# EAGLE schematic smd-practice-manufactured-2016-10-13 (EAGLE 7.6.0)
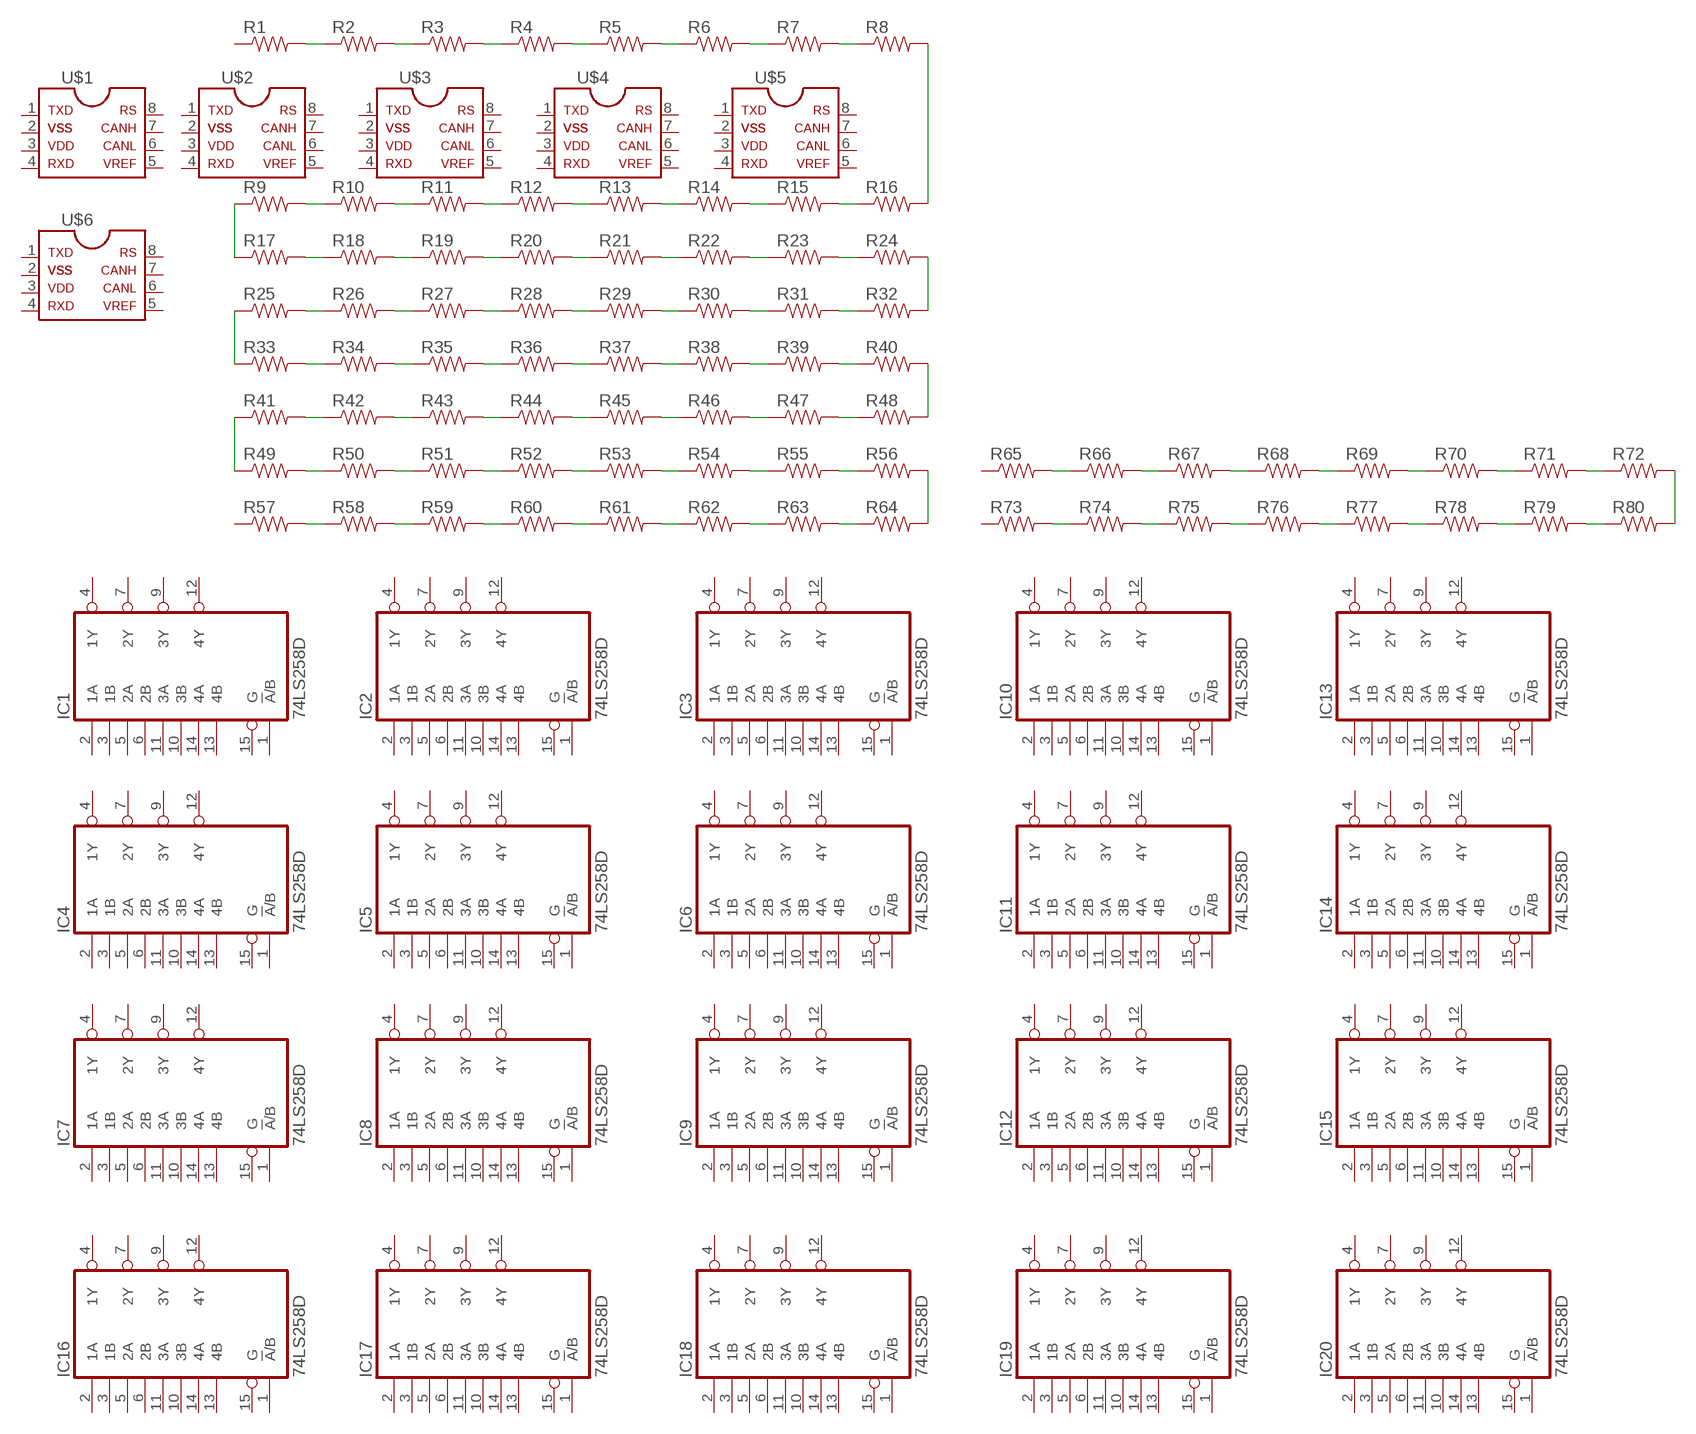
[diagram p0: schematic, sheet 1]

## Parts
IC1  74LS258D  [SO16]
IC2  74LS258D  [SO16]
IC3  74LS258D  [SO16]
IC4  74LS258D  [SO16]
IC5  74LS258D  [SO16]
IC6  74LS258D  [SO16]
IC7  74LS258D  [SO16]
IC8  74LS258D  [SO16]
IC9  74LS258D  [SO16]
IC10  74LS258D  [SO16]
IC11  74LS258D  [SO16]
IC12  74LS258D  [SO16]
IC13  74LS258D  [SO16]
IC14  74LS258D  [SO16]
IC15  74LS258D  [SO16]
IC16  74LS258D  [SO16]
IC17  74LS258D  [SO16]
IC18  74LS258D  [SO16]
IC19  74LS258D  [SO16]
IC20  74LS258D  [SO16]
R1  RESISTOR0805-RES  [0805]
R2  RESISTOR0805-RES  [0805]
R3  RESISTOR0805-RES  [0805]
R4  RESISTOR0805-RES  [0805]
R5  RESISTOR0805-RES  [0805]
R6  RESISTOR0805-RES  [0805]
R7  RESISTOR0805-RES  [0805]
R8  RESISTOR0805-RES  [0805]
R9  RESISTOR0805-RES  [0805]
R10  RESISTOR0805-RES  [0805]
R11  RESISTOR0805-RES  [0805]
R12  RESISTOR0805-RES  [0805]
R13  RESISTOR0805-RES  [0805]
R14  RESISTOR0805-RES  [0805]
R15  RESISTOR0805-RES  [0805]
R16  RESISTOR0805-RES  [0805]
R17  RESISTOR0805-RES  [0805]
R18  RESISTOR0805-RES  [0805]
R19  RESISTOR0805-RES  [0805]
R20  RESISTOR0805-RES  [0805]
R21  RESISTOR0805-RES  [0805]
R22  RESISTOR0805-RES  [0805]
R23  RESISTOR0805-RES  [0805]
R24  RESISTOR0805-RES  [0805]
R25  RESISTOR0805-RES  [0805]
R26  RESISTOR0805-RES  [0805]
R27  RESISTOR0805-RES  [0805]
R28  RESISTOR0805-RES  [0805]
R29  RESISTOR0805-RES  [0805]
R30  RESISTOR0805-RES  [0805]
R31  RESISTOR0805-RES  [0805]
R32  RESISTOR0805-RES  [0805]
R33  RESISTOR0805-RES  [0805]
R34  RESISTOR0805-RES  [0805]
R35  RESISTOR0805-RES  [0805]
R36  RESISTOR0805-RES  [0805]
R37  RESISTOR0805-RES  [0805]
R38  RESISTOR0805-RES  [0805]
R39  RESISTOR0805-RES  [0805]
R40  RESISTOR0805-RES  [0805]
R41  RESISTOR0805-RES  [0805]
R42  RESISTOR0805-RES  [0805]
R43  RESISTOR0805-RES  [0805]
R44  RESISTOR0805-RES  [0805]
R45  RESISTOR0805-RES  [0805]
R46  RESISTOR0805-RES  [0805]
R47  RESISTOR0805-RES  [0805]
R48  RESISTOR0805-RES  [0805]
R49  RESISTOR0805-RES  [0805]
R50  RESISTOR0805-RES  [0805]
R51  RESISTOR0805-RES  [0805]
R52  RESISTOR0805-RES  [0805]
R53  RESISTOR0805-RES  [0805]
R54  RESISTOR0805-RES  [0805]
R55  RESISTOR0805-RES  [0805]
R56  RESISTOR0805-RES  [0805]
R57  RESISTOR0805-RES  [0805]
R58  RESISTOR0805-RES  [0805]
R59  RESISTOR0805-RES  [0805]
R60  RESISTOR0805-RES  [0805]
R61  RESISTOR0805-RES  [0805]
R62  RESISTOR0805-RES  [0805]
R63  RESISTOR0805-RES  [0805]
R64  RESISTOR0805-RES  [0805]
R65  RESISTOR0805-RES  [0805]
R66  RESISTOR0805-RES  [0805]
R67  RESISTOR0805-RES  [0805]
R68  RESISTOR0805-RES  [0805]
R69  RESISTOR0805-RES  [0805]
R70  RESISTOR0805-RES  [0805]
R71  RESISTOR0805-RES  [0805]
R72  RESISTOR0805-RES  [0805]
R73  RESISTOR0805-RES  [0805]
R74  RESISTOR0805-RES  [0805]
R75  RESISTOR0805-RES  [0805]
R76  RESISTOR0805-RES  [0805]
R77  RESISTOR0805-RES  [0805]
R78  RESISTOR0805-RES  [0805]
R79  RESISTOR0805-RES  [0805]
R80  RESISTOR0805-RES  [0805]
U$1  MCP2551  [SOIC-08]
U$2  MCP2551  [SOIC-08]
U$3  MCP2551  [SOIC-08]
U$4  MCP2551  [SOIC-08]
U$5  MCP2551  [SOIC-08]
U$6  MCP2551  [SOIC-08]

## Nets
N$1: R1.2 R2.1
N$2: R2.2 R3.1
N$3: R3.2 R4.1
N$4: R5.2 R6.1
N$5: R6.2 R7.1
N$6: R7.2 R8.1
N$7: R4.2 R5.1
N$8: R9.2 R10.1
N$9: R10.2 R11.1
N$10: R11.2 R12.1
N$11: R13.2 R14.1
N$12: R14.2 R15.1
N$13: R15.2 R16.1
N$14: R12.2 R13.1
N$15: R8.2 R16.2
N$16: R17.2 R18.1
N$17: R18.2 R19.1
N$18: R19.2 R20.1
N$19: R21.2 R22.1
N$20: R22.2 R23.1
N$21: R23.2 R24.1
N$22: R20.2 R21.1
N$23: R25.2 R26.1
N$24: R26.2 R27.1
N$25: R27.2 R28.1
N$26: R29.2 R30.1
N$27: R30.2 R31.1
N$28: R31.2 R32.1
N$29: R28.2 R29.1
N$30: R24.2 R32.2
N$31: R9.1 R17.1
N$32: R33.2 R34.1
N$33: R34.2 R35.1
N$34: R35.2 R36.1
N$35: R37.2 R38.1
N$36: R38.2 R39.1
N$37: R39.2 R40.1
N$38: R36.2 R37.1
N$39: R41.2 R42.1
N$40: R42.2 R43.1
N$41: R43.2 R44.1
N$42: R45.2 R46.1
N$43: R46.2 R47.1
N$44: R47.2 R48.1
N$45: R44.2 R45.1
N$46: R40.2 R48.2
N$47: R49.2 R50.1
N$48: R50.2 R51.1
N$49: R51.2 R52.1
N$50: R53.2 R54.1
N$51: R54.2 R55.1
N$52: R55.2 R56.1
N$53: R52.2 R53.1
N$54: R57.2 R58.1
N$55: R58.2 R59.1
N$56: R59.2 R60.1
N$57: R61.2 R62.1
N$58: R62.2 R63.1
N$59: R63.2 R64.1
N$60: R60.2 R61.1
N$61: R56.2 R64.2
N$62: R41.1 R49.1
N$63: R25.1 R33.1
N$64: R65.2 R66.1
N$65: R66.2 R67.1
N$66: R67.2 R68.1
N$67: R69.2 R70.1
N$68: R70.2 R71.1
N$69: R71.2 R72.1
N$70: R68.2 R69.1
N$71: R73.2 R74.1
N$72: R74.2 R75.1
N$73: R75.2 R76.1
N$74: R77.2 R78.1
N$75: R78.2 R79.1
N$76: R79.2 R80.1
N$77: R76.2 R77.1
N$78: R72.2 R80.2
Unconnected: IC1.1(!A!/B) IC1.2(1A) IC1.3(1B) IC1.4(1Y) IC1.5(2A) IC1.6(2B) IC1.7(2Y) IC1.9(3Y) IC1.10(3B) IC1.11(3A) IC1.12(4Y) IC1.13(4B) IC1.14(4A) IC1.15(G) IC2.1(!A!/B) IC2.2(1A) IC2.3(1B) IC2.4(1Y) IC2.5(2A) IC2.6(2B) IC2.7(2Y) IC2.9(3Y) IC2.10(3B) IC2.11(3A) IC2.12(4Y) IC2.13(4B) IC2.14(4A) IC2.15(G) IC3.1(!A!/B) IC3.2(1A) IC3.3(1B) IC3.4(1Y) IC3.5(2A) IC3.6(2B) IC3.7(2Y) IC3.9(3Y) IC3.10(3B) IC3.11(3A) IC3.12(4Y) IC3.13(4B) IC3.14(4A) IC3.15(G) IC4.1(!A!/B) IC4.2(1A) IC4.3(1B) IC4.4(1Y) IC4.5(2A) IC4.6(2B) IC4.7(2Y) IC4.9(3Y) IC4.10(3B) IC4.11(3A) IC4.12(4Y) IC4.13(4B) IC4.14(4A) IC4.15(G) IC5.1(!A!/B) IC5.2(1A) IC5.3(1B) IC5.4(1Y) IC5.5(2A) IC5.6(2B) IC5.7(2Y) IC5.9(3Y) IC5.10(3B) IC5.11(3A) IC5.12(4Y) IC5.13(4B) IC5.14(4A) IC5.15(G) IC6.1(!A!/B) IC6.2(1A) IC6.3(1B) IC6.4(1Y) IC6.5(2A) IC6.6(2B) IC6.7(2Y) IC6.9(3Y) IC6.10(3B) IC6.11(3A) IC6.12(4Y) IC6.13(4B) IC6.14(4A) IC6.15(G) IC7.1(!A!/B) IC7.2(1A) IC7.3(1B) IC7.4(1Y) IC7.5(2A) IC7.6(2B) IC7.7(2Y) IC7.9(3Y) IC7.10(3B) IC7.11(3A) IC7.12(4Y) IC7.13(4B) IC7.14(4A) IC7.15(G) IC8.1(!A!/B) IC8.2(1A) IC8.3(1B) IC8.4(1Y) IC8.5(2A) IC8.6(2B) IC8.7(2Y) IC8.9(3Y) IC8.10(3B) IC8.11(3A) IC8.12(4Y) IC8.13(4B) IC8.14(4A) IC8.15(G) IC9.1(!A!/B) IC9.2(1A) IC9.3(1B) IC9.4(1Y) IC9.5(2A) IC9.6(2B) IC9.7(2Y) IC9.9(3Y) IC9.10(3B) IC9.11(3A) IC9.12(4Y) IC9.13(4B) IC9.14(4A) IC9.15(G) IC10.1(!A!/B) IC10.2(1A) IC10.3(1B) IC10.4(1Y) IC10.5(2A) IC10.6(2B) IC10.7(2Y) IC10.9(3Y) IC10.10(3B) IC10.11(3A) IC10.12(4Y) IC10.13(4B) IC10.14(4A) IC10.15(G) IC11.1(!A!/B) IC11.2(1A) IC11.3(1B) IC11.4(1Y) IC11.5(2A) IC11.6(2B) IC11.7(2Y) IC11.9(3Y) IC11.10(3B) IC11.11(3A) IC11.12(4Y) IC11.13(4B) IC11.14(4A) IC11.15(G) IC12.1(!A!/B) IC12.2(1A) IC12.3(1B) IC12.4(1Y) IC12.5(2A) IC12.6(2B) IC12.7(2Y) IC12.9(3Y) IC12.10(3B) IC12.11(3A) IC12.12(4Y) IC12.13(4B) IC12.14(4A) IC12.15(G) IC13.1(!A!/B) IC13.2(1A) IC13.3(1B) IC13.4(1Y) IC13.5(2A) IC13.6(2B) IC13.7(2Y) IC13.9(3Y) IC13.10(3B) IC13.11(3A) IC13.12(4Y) IC13.13(4B) IC13.14(4A) IC13.15(G) IC14.1(!A!/B) IC14.2(1A) IC14.3(1B) IC14.4(1Y) IC14.5(2A) IC14.6(2B) IC14.7(2Y) IC14.9(3Y) IC14.10(3B) IC14.11(3A) IC14.12(4Y) IC14.13(4B) IC14.14(4A) IC14.15(G) IC15.1(!A!/B) IC15.2(1A) IC15.3(1B) IC15.4(1Y) IC15.5(2A) IC15.6(2B) IC15.7(2Y) IC15.9(3Y) IC15.10(3B) IC15.11(3A) IC15.12(4Y) IC15.13(4B) IC15.14(4A) IC15.15(G) IC16.1(!A!/B) IC16.2(1A) IC16.3(1B) IC16.4(1Y) IC16.5(2A) IC16.6(2B) IC16.7(2Y) IC16.9(3Y) IC16.10(3B) IC16.11(3A) IC16.12(4Y) IC16.13(4B) IC16.14(4A) IC16.15(G) IC17.1(!A!/B) IC17.2(1A) IC17.3(1B) IC17.4(1Y) IC17.5(2A) IC17.6(2B) IC17.7(2Y) IC17.9(3Y) IC17.10(3B) IC17.11(3A) IC17.12(4Y) IC17.13(4B) IC17.14(4A) IC17.15(G) IC18.1(!A!/B) IC18.2(1A) IC18.3(1B) IC18.4(1Y) IC18.5(2A) IC18.6(2B) IC18.7(2Y) IC18.9(3Y) IC18.10(3B) IC18.11(3A) IC18.12(4Y) IC18.13(4B) IC18.14(4A) IC18.15(G) IC19.1(!A!/B) IC19.2(1A) IC19.3(1B) IC19.4(1Y) IC19.5(2A) IC19.6(2B) IC19.7(2Y) IC19.9(3Y) IC19.10(3B) IC19.11(3A) IC19.12(4Y) IC19.13(4B) IC19.14(4A) IC19.15(G) IC20.1(!A!/B) IC20.2(1A) IC20.3(1B) IC20.4(1Y) IC20.5(2A) IC20.6(2B) IC20.7(2Y) IC20.9(3Y) IC20.10(3B) IC20.11(3A) IC20.12(4Y) IC20.13(4B) IC20.14(4A) IC20.15(G) R1.1 R57.1 R65.1 R73.1 U$1.1 U$1.2 U$1.3 U$1.4 U$1.5 U$1.6 U$1.7 U$1.8 U$2.1 U$2.2 U$2.3 U$2.4 U$2.5 U$2.6 U$2.7 U$2.8 U$3.1 U$3.2 U$3.3 U$3.4 U$3.5 U$3.6 U$3.7 U$3.8 U$4.1 U$4.2 U$4.3 U$4.4 U$4.5 U$4.6 U$4.7 U$4.8 U$5.1 U$5.2 U$5.3 U$5.4 U$5.5 U$5.6 U$5.7 U$5.8 U$6.1 U$6.2 U$6.3 U$6.4 U$6.5 U$6.6 U$6.7 U$6.8

## Power pins joined to a net without a drawn wire
GND: IC1.8(GND) IC2.8(GND) IC3.8(GND) IC4.8(GND) IC5.8(GND) IC6.8(GND) IC7.8(GND) IC8.8(GND) IC9.8(GND) IC10.8(GND) IC11.8(GND) IC12.8(GND) IC13.8(GND) IC14.8(GND) IC15.8(GND) IC16.8(GND) IC17.8(GND) IC18.8(GND) IC19.8(GND) IC20.8(GND)
VCC: IC1.16(VCC) IC2.16(VCC) IC3.16(VCC) IC4.16(VCC) IC5.16(VCC) IC6.16(VCC) IC7.16(VCC) IC8.16(VCC) IC9.16(VCC) IC10.16(VCC) IC11.16(VCC) IC12.16(VCC) IC13.16(VCC) IC14.16(VCC) IC15.16(VCC) IC16.16(VCC) IC17.16(VCC) IC18.16(VCC) IC19.16(VCC) IC20.16(VCC)

## Library data of the parts
IC1-IC20 = 74xx-us:74*258: Quadruple 2-to 1 line data SELECTOR/MULTIPLEXER
R1-R80 = HyTechDevices:RESISTOR: Resistor Basic schematic elements and footprints for 0603, 1206, and PTH resistors.
U$1-U$6 = HyTechDevices:MCP2551: MCP2551 High-Speed CAN Transceiver Product Webpage <https://www.microchip.com/wwwproducts/en/MCP2551> Datasheet <http://ww1.microchip.com/downloads/en/DeviceDoc/21667f.pdf> This device is outdated It is replaced by MCP2561. Comparison Page <https://www.microchip.com/wwwproducts/ProductCompare/MCP2551/MCP2561> Product Webpage <https://www.microchip.com/wwwproducts/en/MCP2561> Datasheet <http://ww1.microchip.com/downloads/en/DeviceDoc/20005167C.pdf>